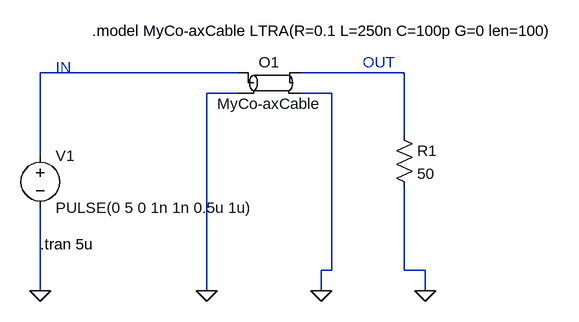
[diagram p0: schematic Lt.asc]
Lt.asc, the LTspice schematic file:
Version 4.1
SHEET 1 996 680
WIRE 448 0 144 0
WIRE 704 0 544 0
WIRE 448 32 400 32
WIRE 592 32 544 32
WIRE 704 96 704 0
WIRE 144 128 144 0
WIRE 592 304 592 32
WIRE 592 304 576 304
WIRE 704 304 704 176
WIRE 736 304 704 304
WIRE 144 336 144 208
WIRE 400 336 400 32
WIRE 576 336 576 304
WIRE 736 336 736 304
FLAG 144 336 0
FLAG 400 336 0
FLAG 576 336 0
FLAG 736 336 0
SYMBOL voltage 144 112 R0
WINDOW 123 0 0 Left 0
WINDOW 39 0 0 Left 0
SYMATTR InstName V1
SYMATTR Value PULSE(0 5 0 1n 1n 0.5u 1u)
SYMBOL ltline 496 16 R0
SYMATTR InstName O1
SYMATTR Value MyCo-axCable
SYMBOL res 688 80 R0
SYMATTR InstName R1
SYMATTR Value 50
TEXT 224 -64 Left 2 !.model MyCo-axCable LTRA(R=0.1 L=250n C=100p G=0 len=100)
TEXT 168 -8 Left 2 ;IN
TEXT 640 -16 Left 2 ;OUT
TEXT 144 264 Left 2 !.tran 5u

The netlist it stands for:
* Lt.asc
V1 N001 0 PULSE(0 5 0 1n 1n 0.5u 1u)
O1 N001 0 N002 0 MyCo-axCable
R1 N002 0 50
.model MyCo-axCable LTRA(R=0.1 L=250n C=100p G=0 len=100)
* IN
* OUT
.tran 5u
.backanno
.end